# EAGLE design Wordclocktest (EAGLE 7.2.0)
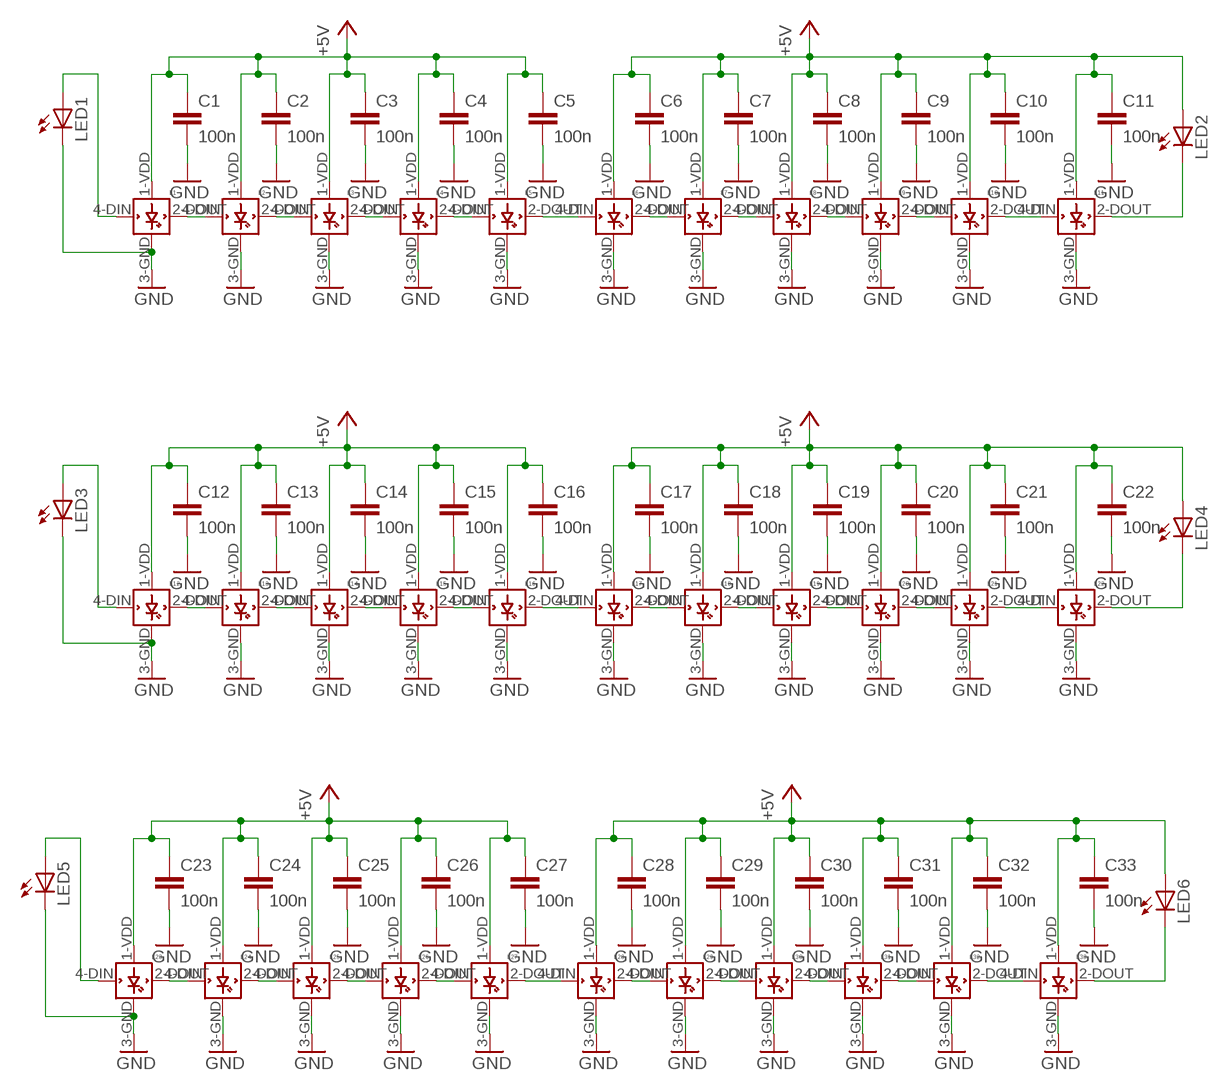
[diagram p0: schematic, sheet 1]

## Parts
C1  100n  C-EUC1310  [C1310]
C2  100n  C-EUC1310  [C1310]
C3  100n  C-EUC1310  [C1310]
C4  100n  C-EUC1310  [C1310]
C5  100n  C-EUC1310  [C1310]
C6  100n  C-EUC1310  [C1310]
C7  100n  C-EUC1310  [C1310]
C8  100n  C-EUC1310  [C1310]
C9  100n  C-EUC1310  [C1310]
C10  100n  C-EUC1310  [C1310]
C11  100n  C-EUC1310  [C1310]
C12  100n  C-EUC1310  [C1310]
C13  100n  C-EUC1310  [C1310]
C14  100n  C-EUC1310  [C1310]
C15  100n  C-EUC1310  [C1310]
C16  100n  C-EUC1310  [C1310]
C17  100n  C-EUC1310  [C1310]
C18  100n  C-EUC1310  [C1310]
C19  100n  C-EUC1310  [C1310]
C20  100n  C-EUC1310  [C1310]
C21  100n  C-EUC1310  [C1310]
C22  100n  C-EUC1310  [C1310]
C23  100n  C-EUC1310  [C1310]
C24  100n  C-EUC1310  [C1310]
C25  100n  C-EUC1310  [C1310]
C26  100n  C-EUC1310  [C1310]
C27  100n  C-EUC1310  [C1310]
C28  100n  C-EUC1310  [C1310]
C29  100n  C-EUC1310  [C1310]
C30  100n  C-EUC1310  [C1310]
C31  100n  C-EUC1310  [C1310]
C32  100n  C-EUC1310  [C1310]
C33  100n  C-EUC1310  [C1310]
L1  WS2812B  [WS2812B]
L2  WS2812B  [WS2812B]
L3  WS2812B  [WS2812B]
L4  WS2812B  [WS2812B]
L5  WS2812B  [WS2812B]
L6  WS2812B  [WS2812B]
L7  WS2812B  [WS2812B]
L8  WS2812B  [WS2812B]
L9  WS2812B  [WS2812B]
L10  WS2812B  [WS2812B]
L11  WS2812B  [WS2812B]
L12  WS2812B  [WS2812B]
L13  WS2812B  [WS2812B]
L14  WS2812B  [WS2812B]
L15  WS2812B  [WS2812B]
L16  WS2812B  [WS2812B]
L17  WS2812B  [WS2812B]
L18  WS2812B  [WS2812B]
L19  WS2812B  [WS2812B]
L20  WS2812B  [WS2812B]
L21  WS2812B  [WS2812B]
L22  WS2812B  [WS2812B]
L23  WS2812B  [WS2812B]
L24  WS2812B  [WS2812B]
L25  WS2812B  [WS2812B]
L26  WS2812B  [WS2812B]
L27  WS2812B  [WS2812B]
L28  WS2812B  [WS2812B]
L29  WS2812B  [WS2812B]
L30  WS2812B  [WS2812B]
L31  WS2812B  [WS2812B]
L32  WS2812B  [WS2812B]
L33  WS2812B  [WS2812B]
LED1  LEDCHIP-LED0603  [CHIP-LED0603]
LED2  LEDCHIP-LED0603  [CHIP-LED0603]
LED3  LEDCHIP-LED0603  [CHIP-LED0603]
LED4  LEDCHIP-LED0603  [CHIP-LED0603]
LED5  LEDCHIP-LED0603  [CHIP-LED0603]
LED6  LEDCHIP-LED0603  [CHIP-LED0603]

## Nets
+5V: C1.1 C2.1 C3.1 C4.1 C5.1 C6.1 C7.1 C8.1 C9.1 C10.1 C11.1 C12.1 C13.1 C14.1 C15.1 C16.1 C17.1 C18.1 C19.1 C20.1 C21.1 C22.1 C23.1 C24.1 C25.1 C26.1 C27.1 C28.1 C29.1 C30.1 C31.1 C32.1 C33.1 L1.1-VDD(VDD) L2.1-VDD(VDD) L3.1-VDD(VDD) L4.1-VDD(VDD) L5.1-VDD(VDD) L6.1-VDD(VDD) L7.1-VDD(VDD) L8.1-VDD(VDD) L9.1-VDD(VDD) L10.1-VDD(VDD) L11.1-VDD(VDD) L12.1-VDD(VDD) L13.1-VDD(VDD) L14.1-VDD(VDD) L15.1-VDD(VDD) L16.1-VDD(VDD) L17.1-VDD(VDD) L18.1-VDD(VDD) L19.1-VDD(VDD) L20.1-VDD(VDD) L21.1-VDD(VDD) L22.1-VDD(VDD) L23.1-VDD(VDD) L24.1-VDD(VDD) L25.1-VDD(VDD) L26.1-VDD(VDD) L27.1-VDD(VDD) L28.1-VDD(VDD) L29.1-VDD(VDD) L30.1-VDD(VDD) L31.1-VDD(VDD) L32.1-VDD(VDD) L33.1-VDD(VDD) LED2.A LED4.A LED6.A
GND: C1.2 C2.2 C3.2 C4.2 C5.2 C6.2 C7.2 C8.2 C9.2 C10.2 C11.2 C12.2 C13.2 C14.2 C15.2 C16.2 C17.2 C18.2 C19.2 C20.2 C21.2 C22.2 C23.2 C24.2 C25.2 C26.2 C27.2 C28.2 C29.2 C30.2 C31.2 C32.2 C33.2 L1.3-GND(GND) L2.3-GND(GND) L3.3-GND(GND) L4.3-GND(GND) L5.3-GND(GND) L6.3-GND(GND) L7.3-GND(GND) L8.3-GND(GND) L9.3-GND(GND) L10.3-GND(GND) L11.3-GND(GND) L12.3-GND(GND) L13.3-GND(GND) L14.3-GND(GND) L15.3-GND(GND) L16.3-GND(GND) L17.3-GND(GND) L18.3-GND(GND) L19.3-GND(GND) L20.3-GND(GND) L21.3-GND(GND) L22.3-GND(GND) L23.3-GND(GND) L24.3-GND(GND) L25.3-GND(GND) L26.3-GND(GND) L27.3-GND(GND) L28.3-GND(GND) L29.3-GND(GND) L30.3-GND(GND) L31.3-GND(GND) L32.3-GND(GND) L33.3-GND(GND) LED1.C LED3.C LED5.C
N$1: L1.2-DOUT(DOUT) L2.4-DIN(DIN)
N$2: L2.2-DOUT(DOUT) L3.4-DIN(DIN)
N$3: L3.2-DOUT(DOUT) L4.4-DIN(DIN)
N$4: L4.2-DOUT(DOUT) L5.4-DIN(DIN)
N$5: L6.2-DOUT(DOUT) L7.4-DIN(DIN)
N$6: L5.2-DOUT(DOUT) L6.4-DIN(DIN)
N$7: L7.2-DOUT(DOUT) L8.4-DIN(DIN)
N$8: L8.2-DOUT(DOUT) L9.4-DIN(DIN)
N$9: L9.2-DOUT(DOUT) L10.4-DIN(DIN)
N$10: L10.2-DOUT(DOUT) L11.4-DIN(DIN)
N$11: L12.2-DOUT(DOUT) L13.4-DIN(DIN)
N$12: L1.4-DIN(DIN) LED1.A
N$13: L13.2-DOUT(DOUT) L14.4-DIN(DIN)
N$14: L14.2-DOUT(DOUT) L15.4-DIN(DIN)
N$15: L15.2-DOUT(DOUT) L16.4-DIN(DIN)
N$16: L16.2-DOUT(DOUT) L17.4-DIN(DIN)
N$17: L17.2-DOUT(DOUT) L18.4-DIN(DIN)
N$18: L18.2-DOUT(DOUT) L19.4-DIN(DIN)
N$19: L19.2-DOUT(DOUT) L20.4-DIN(DIN)
N$20: L20.2-DOUT(DOUT) L21.4-DIN(DIN)
N$21: L21.2-DOUT(DOUT) L22.4-DIN(DIN)
N$22: L12.4-DIN(DIN) LED3.A
N$23: L23.2-DOUT(DOUT) L24.4-DIN(DIN)
N$24: L24.2-DOUT(DOUT) L25.4-DIN(DIN)
N$25: L25.2-DOUT(DOUT) L26.4-DIN(DIN)
N$26: L26.2-DOUT(DOUT) L27.4-DIN(DIN)
N$27: L27.2-DOUT(DOUT) L28.4-DIN(DIN)
N$28: L28.2-DOUT(DOUT) L29.4-DIN(DIN)
N$29: L29.2-DOUT(DOUT) L30.4-DIN(DIN)
N$30: L30.2-DOUT(DOUT) L31.4-DIN(DIN)
N$31: L31.2-DOUT(DOUT) L32.4-DIN(DIN)
N$32: L32.2-DOUT(DOUT) L33.4-DIN(DIN)
N$33: L23.4-DIN(DIN) LED5.A
OUTROW1: L11.2-DOUT(DOUT) LED2.C
OUTROW2: L22.2-DOUT(DOUT) LED4.C
OUTROW3: L33.2-DOUT(DOUT) LED6.C

## Library data of the parts
C1-C33 = rcl:C-EU: CAPACITOR, European symbol
L1-L33 = adafruit:WS2812B
LED1-LED6 = led:LED: LED OSRAM: - CHIPLED LG R971, LG N971, LY N971, LG Q971, LY Q971, LO R971, LY R971 LH N974, LH R974 LS Q976, LO Q976, LY Q976 LO Q996 - Hyper CHIPLED LW Q18S LB Q993, LB Q99A, LB R99A - SideLED LS A670, LO A670, LY A670, LG A670, LP A670 LB A673, LV A673, LT A673, LW A673 LH A674 LY A675 LS A676, LA A676, LO A676, LY A676, LW A676 LS A679, LY A679, LG A679 - Hyper Micro SIDELED® LS Y876, LA Y876, LO Y876, LY Y876 LT Y87S - SmartLED LW L88C, LW L88S LB L89C, LB L89S, LG L890 LS L89K, LO L89K, LY L89K LS L896, LA L896, LO L896, LY L896 - TOPLED LS T670, LO T670, LY T670, LG T670, LP T670 LSG T670, LSP T670, LSY T670, LOP T670, LYG T670 LG T671, LOG T671, LSG T671 LB T673, LV T673, LT T673, LW T673 LH T674 LS T676, LA T676, LO T676, LY T676, LB T676, LH T676, LSB T676, LW T676 LB T67C, LV T67C, LT T67C, LS T67K, LO T67K, LY T67K, LW E67C LS E67B, LA E67B, LO E67B, LY E67B, LB E67C, LV E67C, LT E67C LW T67C LS T679, LY T679, LG T679 LS T770, LO T770, LY T770, LG T770, LP T770 LB T773, LV T773, LT T773, LW T773 LH T774 LS E675, LA E675, LY E675, LS T675 LS T776, LA T776, LO T776, LY T776, LB T776 LHGB T686 LT T68C, LB T68C - Hyper Mini TOPLED® LB M676 - Mini TOPLED Santana® LG M470 LS M47K, LO M47K, LY M47K Source: http://www.osram.convergy.de LUXEON: - LUMILED® LXK2-PW12-R00, LXK2-PW12-S00, LXK2-PW14-U00, LXK2-PW14-V00 LXK2-PM12-R00, LXK2-PM12-S00, LXK2-PM14-U00 LXK2-PE12-Q00, LXK2-PE12-R00, LXK2-PE12-S00, LXK2-PE14-T00, LXK2-PE14-U00 LXK2-PB12-K00, LXK2-PB12-L00, LXK2-PB12-M00, LXK2-PB14-N00, LXK2-PB14-P00, LXK2-PB14-Q00 LXK2-PR12-L00, LXK2-PR12-M00, LXK2-PR14-Q00, LXK2-PR14-R00 LXK2-PD12-Q00, LXK2-PD12-R00, LXK2-PD12-S00 LXK2-PH12-R00, LXK2-PH12-S00 LXK2-PL12-P00, LXK2-PL12-Q00, LXK2-PL12-R00 Source: www.luxeon.com KINGBRIGHT: KA-3528ASYC Source: www.kingbright.com

## Board
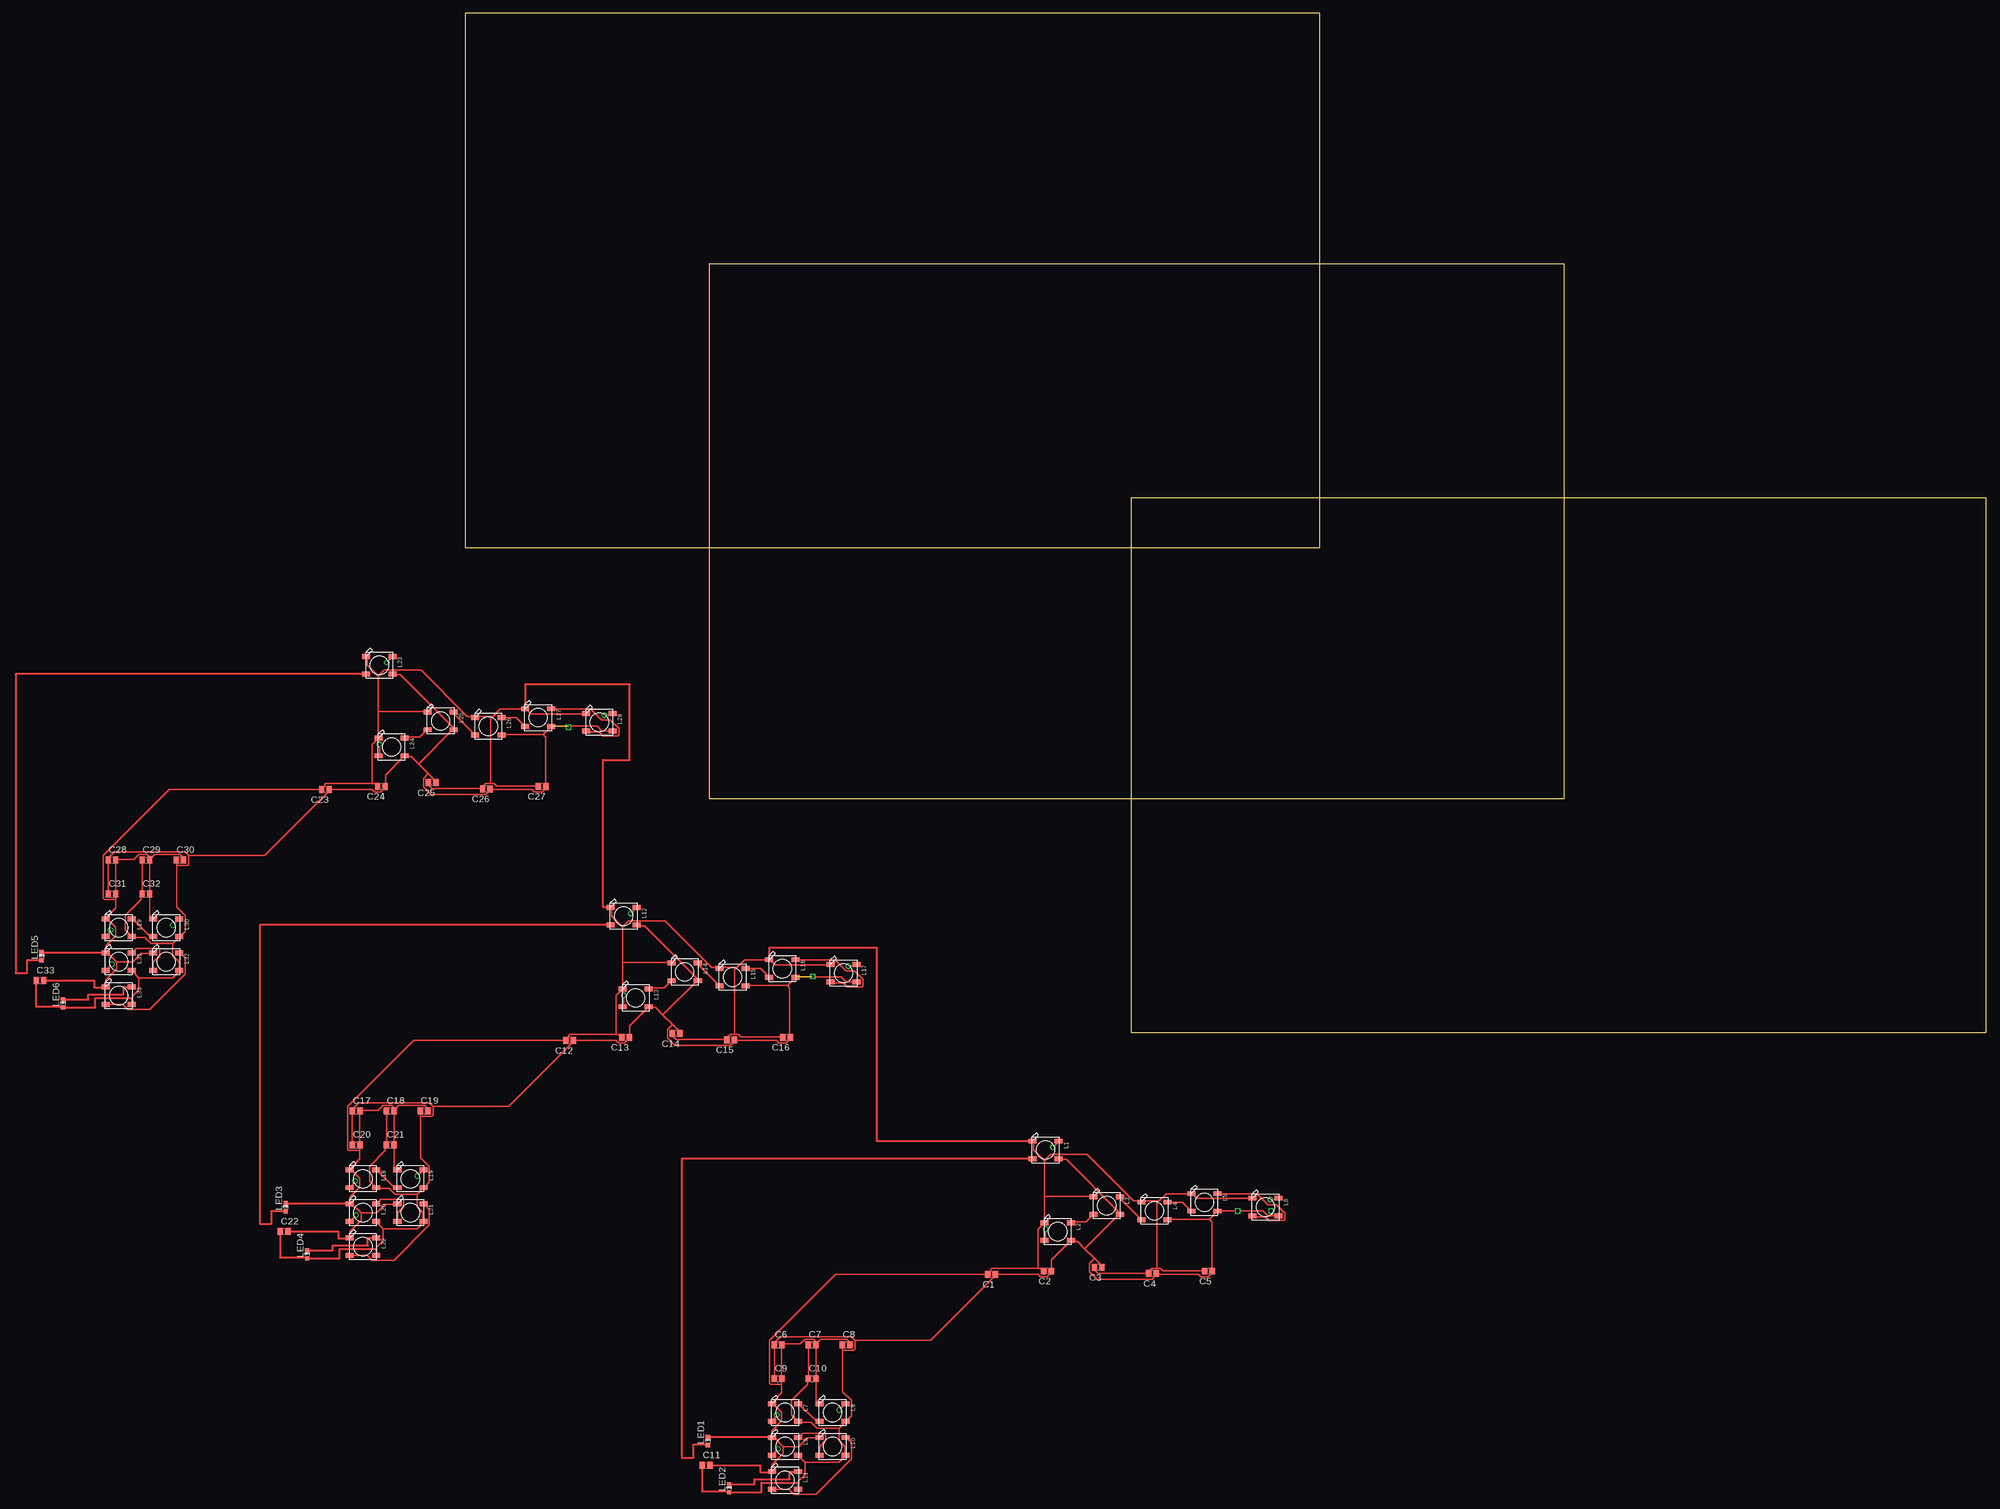
[diagram p1: board, top side]
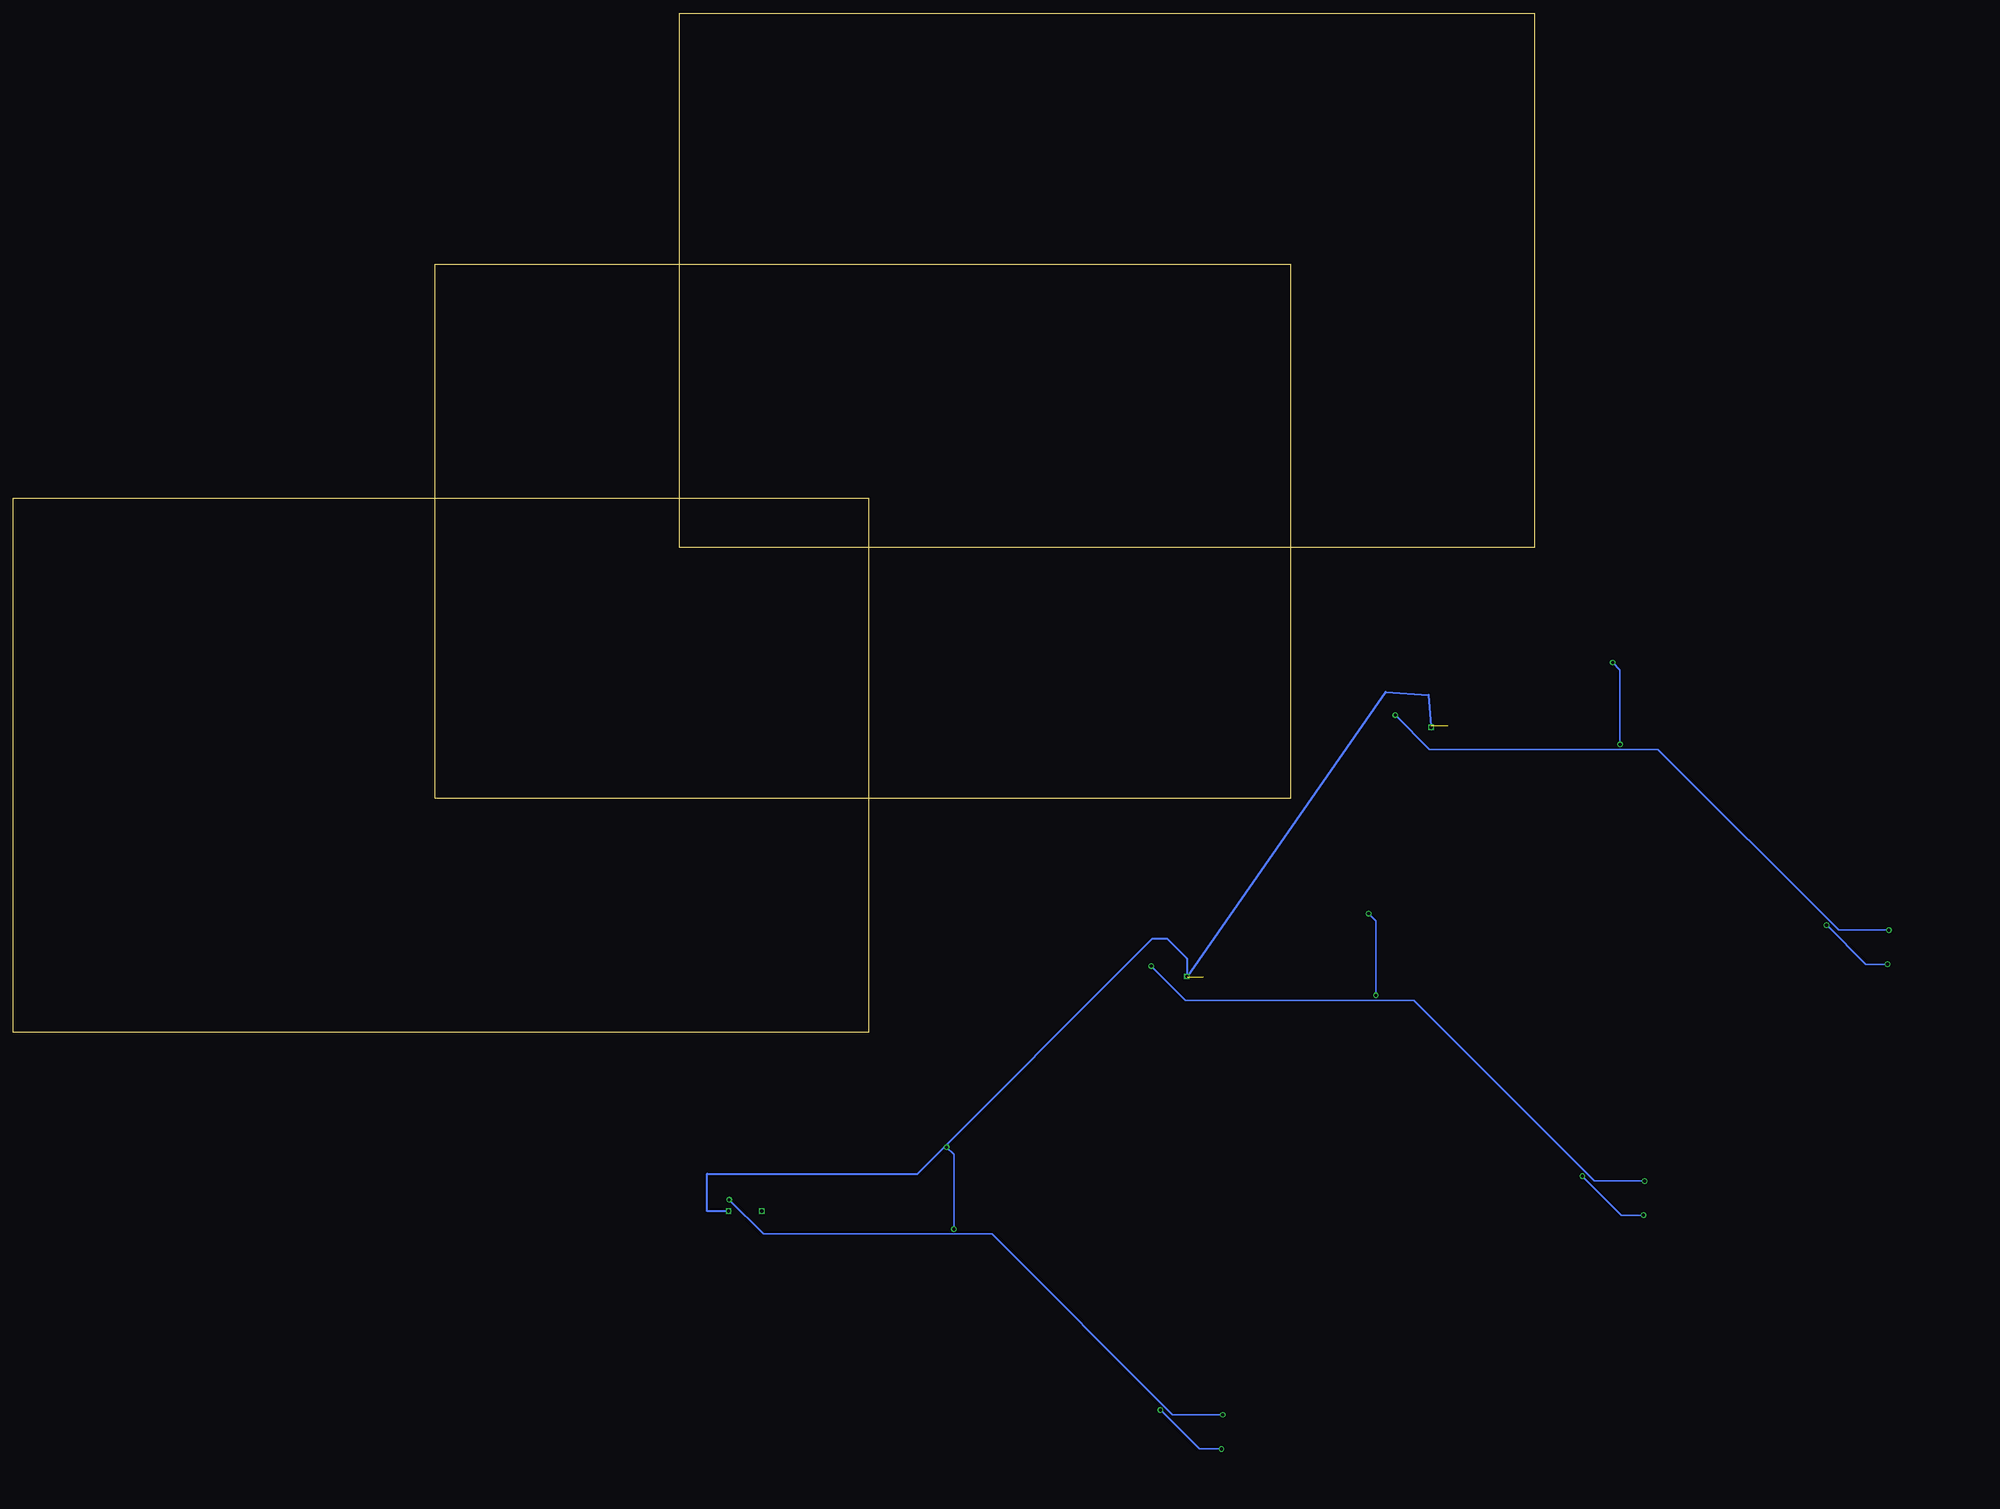
[diagram p2: board, bottom side, seen from below]

Size 284.65 x 190.71 mm. Coordinates in mm from the lower left corner, seen from the top.
Outline: 124.65,0 284.65,0 284.65,100 124.65,100 124.65,0
Outline: 45.69,43.75 205.69,43.75 205.69,143.75 45.69,143.75 45.69,43.75
Outline: 0,90.71 160,90.71 160,190.71 0,190.71 0,90.71
Copper layers (1*16): Top 0.035mm / dielectric 1.5mm / Bottom 0.035mm
Design rules "default": minimum track width 10mil, minimum drill 24mil, track to track 8mil, track to pad 8mil, pad to pad 8mil, via to via 8mil, smd to smd 8mil, copper to edge 40mil, drill to drill 8mil, minimum pad ring 10mil, minimum via ring 8mil, stop-mask expansion 4mil, vias tented up to drill 0mil, thermal gap 10mil

### Footprints (pad centres in the part's own frame; a part is rotated, then mirrored left to right if it is on the bottom)
C1310 = smd 1 x 1.3: 1 -0.7,0; 2 0.7,0
WS2812B = smd 1.5 x 0.9: 1-VDD 2.45,-1.65; 2-DOUT 2.45,1.65; 3-GND -2.45,1.65; 4-DIN -2.45,-1.65
CHIP-LED0603 = smd 0.8 x 0.8: A 0,-0.75; C 0,0.75

### Placement (x,y rotation side)
C1  98.55,-45.26 180 top  (outside the outline)
C2  109.02,-44.65 180 top  (outside the outline)
C3  118.49,-43.97 180 top  (outside the outline)
C4  128.65,-45.11 180 top  (outside the outline)
C5  139.12,-44.65 180 top  (outside the outline)
C6  58.61,-58.42 0 top  (outside the outline)
C7  64.96,-58.42 0 top  (outside the outline)
C8  71.31,-58.42 0 top  (outside the outline)
C9  58.61,-64.77 0 top  (outside the outline)
C10  64.96,-64.77 0 top  (outside the outline)
C11  45.12,-81 0 top  (outside the outline)
C12  19.59,-1.51 180 top
C13  30.06,-0.9 180 top
C14  39.53,-0.22 180 top
C15  49.69,-1.36 180 top
C16  60.16,-0.9 180 top
C17  -20.35,-14.67 0 top  (outside the outline)
C18  -14,-14.67 0 top  (outside the outline)
C19  -7.65,-14.67 0 top  (outside the outline)
C20  -20.35,-21.02 0 top  (outside the outline)
C21  -14,-21.02 0 top  (outside the outline)
C22  -33.84,-37.25 0 top  (outside the outline)
C23  -26.1,45.45 180 top  (outside the outline)
C24  -15.64,46.06 180 top  (outside the outline)
C25  -6.16,46.74 180 top  (outside the outline)
C26  4,45.6 180 top
C27  14.46,46.06 180 top
C28  -66.04,32.29 0 top  (outside the outline)
C29  -59.69,32.29 0 top  (outside the outline)
C30  -53.34,32.29 0 top  (outside the outline)
C31  -66.04,25.94 0 top  (outside the outline)
C32  -59.69,25.94 0 top  (outside the outline)
C33  -79.53,9.71 0 top  (outside the outline)
L1  108.65,-22 0 top  (outside the outline)
L2  110.92,-37.27 0 top  (outside the outline)
L3  120.09,-32.41 0 top  (outside the outline)
L4  129.03,-33.4 0 top  (outside the outline)
L5  138.36,-31.8 0 top  (outside the outline)
L6  149.8,-32.67 0 top  (outside the outline)
L7  59.88,-71.12 0 top  (outside the outline)
L8  68.77,-71.12 0 top  (outside the outline)
L9  59.88,-77.47 0 top  (outside the outline)
L10  68.77,-77.47 0 top  (outside the outline)
L11  59.88,-83.82 0 top  (outside the outline)
L12  29.69,21.75 0 top
L13  31.96,6.48 0 top
L14  41.13,11.34 0 top
L15  50.07,10.36 0 top
L16  59.4,11.95 0 top
L17  70.84,11.09 0 top
L18  -19.08,-27.37 0 top  (outside the outline)
L19  -10.19,-27.37 0 top  (outside the outline)
L20  -19.08,-33.72 0 top  (outside the outline)
L21  -10.19,-33.72 0 top  (outside the outline)
L22  -19.08,-40.07 0 top  (outside the outline)
L23  -16,68.71 0 top  (outside the outline)
L24  -13.74,53.44 0 top  (outside the outline)
L25  -4.56,58.3 0 top
L26  4.38,57.32 0 top
L27  13.7,58.91 0 top
L28  25.15,58.05 0 top
L29  -64.77,19.59 0 top  (outside the outline)
L30  -55.88,19.59 0 top  (outside the outline)
L31  -64.77,13.24 0 top  (outside the outline)
L32  -55.88,13.24 0 top  (outside the outline)
L33  -64.77,6.89 0 top  (outside the outline)
LED1  45.44,-76.45 0 top  (outside the outline)
LED2  49.43,-85.29 0 top  (outside the outline)
LED3  -33.52,-32.7 0 top  (outside the outline)
LED4  -29.53,-41.54 0 top  (outside the outline)
LED5  -79.22,14.26 0 top  (outside the outline)
LED6  -75.23,5.43 0 top  (outside the outline)

### Tracks (layer width: path | path; a pad name or v marks a point on that pad's centre or on a via)
+5V  (via drill 0.6)  (2 unrouted)
  Top 0.254: 63.62,-80.47 63.62,-82.75 62.47,-83.9 62.47,-85.27 L11.1-VDD | 63.62,-80.47 62.47,-79.32 L9.1-VDD | C7.1 64.3,-58.52 64.3,-64.69 C10.1 64.07,-64.92 64.07,-65.84 61.1,-68.81 61.1,-71.55 62.24,-72.69 L7.1-VDD 62.47,-72.92 64.76,-72.92 65.9,-74.07 70.02,-74.07 | C9.1 57.9,-64.69 57.9,-58.52 C6.1 58.13,-58.29 58.13,-57.84 59.04,-56.92 72.3,-56.92 72.99,-57.61 | 70.7,-59.44 70.7,-67.21 72.3,-68.81 72.3,-71.78 71.39,-72.69 L8.1-VDD 71.16,-72.92 70.02,-74.07 | 70.7,-59.44 70.7,-58.52 C8.1 | 70.02,-74.07 70.02,-76.35 71.16,-77.5 71.16,-79.1 L10.1-VDD 71.16,-79.32 70.02,-80.47 63.62,-80.47 | 72.99,-57.61 72.99,-59.21 72.76,-59.44 70.7,-59.44 | 139.28,-34.98 131.51,-34.98 L4.1-VDD | 139.28,-34.98 140.65,-33.6 L5.1-VDD 140.88,-33.38 149.34,-33.38 150.26,-34.29 152.08,-34.29 L6.1-VDD | 139.28,-34.98 139.74,-35.43 139.74,-44.58 C5.1 139.97,-44.81 139.05,-45.72 137.68,-45.72 137.23,-45.26 129.45,-45.26 C4.1 129.22,-45.26 129.22,-45.49 128.54,-46.18 118.25,-46.18 116.88,-44.81 116.88,-43.2 117.79,-42.29 | 99.51,-45.26 107.28,-45.26 107.74,-45.72 108.88,-45.72 109.79,-44.81 C2.1 109.79,-44.58 109.79,-42.52 113.22,-39.09 L2.1-VDD 113.45,-39.09 114.59,-39.09 115.97,-40.46 | 99.51,-45.26 99.28,-45.26 C1.1 99.51,-45.26 | 115.97,-40.46 117.79,-42.29 | 117.79,-42.29 118.71,-43.2 118.71,-43.43 119.17,-43.89 C3.1 | 115.97,-40.46 122.37,-34.06 L3.1-VDD 122.6,-33.83 112.54,-23.77 111.17,-23.77 L1.1-VDD | 72.99,-57.61 87.16,-57.61 99.51,-45.26 | -15.34,-36.72 -15.34,-39 -16.49,-40.15 -16.49,-41.52 L22.1-VDD | -15.34,-36.72 -16.49,-35.57 L20.1-VDD | C18.1 -14.66,-14.77 -14.66,-20.94 C21.1 -14.89,-21.17 -14.89,-22.09 -17.86,-25.06 -17.86,-27.8 -16.72,-28.95 L18.1-VDD -16.49,-29.17 -14.2,-29.17 -13.06,-30.32 -8.94,-30.32
  Top 0.254: C20.1 -21.06,-20.94 -21.06,-14.77 C17.1 -20.83,-14.54 -20.83,-14.09 -19.92,-13.17 -6.66,-13.17 -5.97,-13.86 | -8.26,-15.69 -8.26,-23.46 -6.66,-25.06 -6.66,-28.03 -7.57,-28.95 L19.1-VDD -7.8,-29.17 -8.94,-30.32 | -8.26,-15.69 -8.26,-14.77 C19.1 | -8.94,-30.32 -8.94,-32.6 -7.8,-33.74 -7.8,-35.34 L21.1-VDD -7.8,-35.57 -8.94,-36.72 -15.34,-36.72 | -5.97,-13.86 -5.97,-15.46 -6.2,-15.69 -8.26,-15.69 | 60.32,8.77 52.55,8.77 L15.1-VDD | 60.32,8.77 61.69,10.15 L16.1-VDD 61.92,10.38 70.38,10.38 71.3,9.46 73.12,9.46 L17.1-VDD | 60.32,8.77 60.78,8.32 60.78,-0.83 C16.1 61.01,-1.05 60.09,-1.97 58.72,-1.97 58.27,-1.51 50.49,-1.51 C15.1 50.26,-1.51 50.26,-1.74 49.58,-2.43 39.29,-2.43 37.92,-1.05 37.92,0.55 38.83,1.46 | 20.55,-1.51 28.32,-1.51 28.78,-1.97 29.92,-1.97 30.83,-1.05 C13.1 30.83,-0.83 30.83,1.23 34.26,4.66 L13.1-VDD 34.49,4.66 35.63,4.66 37.01,3.29 | 20.55,-1.51 20.32,-1.51 C12.1 20.55,-1.51 | 37.01,3.29 38.83,1.46 | 38.83,1.46 39.75,0.55 39.75,0.32 40.21,-0.14 C14.1 | 37.01,3.29 43.41,9.69 L14.1-VDD 43.64,9.92 33.58,19.98 32.21,19.98 L12.1-VDD | -5.97,-13.86 8.2,-13.86 20.55,-1.51 | -61.04,10.24 -61.04,7.96 -62.18,6.82 -62.18,5.44 L33.1-VDD | -61.04,10.24 -62.18,11.39 L31.1-VDD | C29.1 -60.35,32.19 -60.35,26.02 C32.1 -60.58,25.79 -60.58,24.88 -63.55,21.9 -63.55,19.16 -62.41,18.02 L29.1-VDD -62.18,17.79 -59.89,17.79 -58.75,16.64 -54.64,16.64 | C31.1 -66.75,26.02 -66.75,32.19 C28.1 -66.52,32.42 -66.52,32.88 -65.61,33.79 -52.35,33.79 -51.66,33.1 | -53.95,31.27 -53.95,23.5 -52.35,21.9 -52.35,18.93 -53.26,18.02 L30.1-VDD -53.49,17.79 -54.64,16.64
  Top 0.254: -53.95,31.27 -53.95,32.19 C30.1 | -54.64,16.64 -54.64,14.36 -53.49,13.22 -53.49,11.62 L32.1-VDD -53.49,11.39 -54.64,10.24 -61.04,10.24 | -51.66,33.1 -51.66,31.5 -51.89,31.27 -53.95,31.27 | 14.63,55.74 6.86,55.74 L26.1-VDD | 14.63,55.74 16,57.11 L27.1-VDD 16.23,57.34 24.69,57.34 25.6,56.42 27.43,56.42 L28.1-VDD | 14.63,55.74 15.09,55.28 15.09,46.13 C27.1 15.32,45.91 14.4,44.99 13.03,44.99 12.57,45.45 4.8,45.45 C26.1 4.57,45.45 4.57,45.22 3.89,44.53 -6.4,44.53 -7.77,45.91 -7.77,47.51 -6.86,48.42 | -25.15,45.45 -17.37,45.45 -16.92,44.99 -15.77,44.99 -14.86,45.91 C24.1 -14.86,46.13 -14.86,48.19 -11.43,51.62 L24.1-VDD -11.2,51.62 -10.06,51.62 -8.69,50.25 | -25.15,45.45 -25.37,45.45 C23.1 -25.15,45.45 | -8.69,50.25 -6.86,48.42 | -6.86,48.42 -5.94,47.51 -5.94,47.28 -5.49,46.82 C25.1 | -8.69,50.25 -2.29,56.65 L25.1-VDD -2.06,56.88 -12.12,66.94 -13.49,66.94 L23.1-VDD | -51.66,33.1 -37.49,33.1 -25.15,45.45
  Top 0.406: C11.1 44.37,-81 44.37,-85.88 49.43,-85.88 LED2.A 55.5,-86.04 55.5,-84.26 62.33,-84.26 L11.1-VDD | C22.1 -34.59,-37.25 -34.59,-42.13 -29.53,-42.13 LED4.A -23.46,-42.29 -23.46,-40.51 -16.63,-40.51 L22.1-VDD | C33.1 -80.29,9.71 -80.29,4.83 -75.23,4.83 LED6.A -69.15,4.67 -69.15,6.45 -62.32,6.45 L33.1-VDD | L6.1-VDD 150.83,-34.31 v150.83,-33.44
  Bottom 0.406: v150.83,-33.44 154.82,-33.44 154.82,-26.42 115.43,-26.42 71.46,17.56 68.79,17.56 65.05,13.82 65.05,10.44 64.98,10.38 27.84,63.74 19.86,63.17 19.38,57.34
GND
  Top 0.254: 127.62,-45.03 118.48,-45.03 117.57,-44.12 C3.2 | 127.62,-45.03 127.85,-45.03 C4.2 127.62,-45.03 | 129.45,-44.12 128.54,-44.12 127.62,-45.03 | 129.45,-44.12 130.14,-44.12 130.6,-44.58 138.37,-44.58 C5.2 | 129.45,-31.55 129.91,-31.55 131.28,-30.18 135.85,-30.18 L5.3-GND 136.08,-30.18 137,-31.09 147.28,-31.09 L6.3-GND | 129.45,-31.55 126.71,-31.55 L4.3-GND 126.48,-31.55 125.11,-31.55 116.42,-22.86 109.56,-22.86 108.42,-24 | 129.45,-31.55 129.45,-44.12 | 59.5,-77.5 59.5,-78.87 57.44,-80.92 57.44,-82.07 L11.3-GND | 59.5,-77.5 57.9,-75.89 57.44,-75.89 L9.3-GND 57.44,-75.67 57.44,-74.52 59.27,-72.69 59.27,-71.09 57.44,-69.27 | 59.5,-77.5 62.47,-77.5 64.07,-75.89 66.13,-75.89 L10.3-GND | 59.27,-65.84 59.27,-67.44 57.44,-69.27 | 59.27,-65.84 59.27,-64.92 C9.2 59.27,-64.69 59.27,-58.52 C6.2 59.5,-58.29 62.7,-58.29 63.62,-57.38 65.22,-57.38 65.9,-58.06 | L8.3-GND 66.13,-69.27 65.67,-68.81 65.67,-64.92 C10.2 65.67,-64.69 65.67,-58.52 C7.2 | 65.9,-58.06 65.67,-58.29 C7.2 | 65.9,-58.06 66.59,-57.38 71.39,-57.38 71.85,-57.84 71.85,-58.29 C8.2 | 65.9,-58.06 C7.2 | 57.44,-69.27 L7.3-GND | 107.28,-44.12 107.74,-44.12 108.19,-44.58 C2.2 | 107.28,-44.12 98.59,-44.12 98.36,-44.35 98.36,-44.58 97.91,-45.03 C1.2 97.68,-45.26 69.33,-45.26 56.99,-57.61 56.99,-65.61 57.22,-65.84 59.27,-65.84 | 107.28,-44.12 107.28,-36.8 108.42,-35.66 L2.3-GND 108.42,-35.43 108.42,-30.63 | 108.42,-24 106.36,-21.95 106.36,-20.57 L1.3-GND | 108.42,-30.63 108.42,-24 | 108.42,-30.63 117.57,-30.63 L3.3-GND | 48.66,-1.28 39.52,-1.28 38.61,-0.37 C14.2 | 48.66,-1.28 48.89,-1.28 C15.2 48.66,-1.28 | 50.49,-0.37 49.58,-0.37 48.66,-1.28
  Top 0.254: 50.49,-0.37 51.18,-0.37 51.64,-0.83 59.41,-0.83 C16.2 | 50.49,12.2 50.95,12.2 52.32,13.57 56.89,13.57 L16.3-GND 57.12,13.57 58.04,12.66 68.32,12.66 L17.3-GND | 50.49,12.2 47.75,12.2 L15.3-GND 47.52,12.2 46.15,12.2 37.46,20.89 30.61,20.89 29.46,19.75 | 50.49,12.2 50.49,-0.37 | -19.46,-33.74 -19.46,-35.12 -21.52,-37.17 -21.52,-38.32 L22.3-GND | -19.46,-33.74 -21.06,-32.15 -21.52,-32.15 L20.3-GND -21.52,-31.92 -21.52,-30.77 -19.69,-28.95 -19.69,-27.34 -21.52,-25.52 | -19.46,-33.74 -16.49,-33.74 -14.89,-32.15 -12.83,-32.15 L21.3-GND | -19.69,-22.09 -19.69,-23.69 -21.52,-25.52 | -19.69,-22.09 -19.69,-21.17 C20.2 -19.69,-20.94 -19.69,-14.77 C17.2 -19.46,-14.54 -16.26,-14.54 -15.34,-13.63 -13.74,-13.63 -13.06,-14.31 | L19.3-GND -12.83,-25.52 -13.29,-25.06 -13.29,-21.17 C21.2 -13.29,-20.94 -13.29,-14.77 C18.2 | -13.06,-14.31 -13.29,-14.54 C18.2 | -13.06,-14.31 -12.37,-13.63 -7.57,-13.63 -7.11,-14.09 -7.11,-14.54 C19.2 | -13.06,-14.31 C18.2 | -21.52,-25.52 L18.3-GND | 28.32,-0.37 28.78,-0.37 29.23,-0.83 C13.2 | 28.32,-0.37 19.63,-0.37 19.4,-0.6 19.4,-0.83 18.95,-1.28 C12.2 18.72,-1.51 -9.63,-1.51 -21.97,-13.86 -21.97,-21.86 -21.74,-22.09 -19.69,-22.09 | 28.32,-0.37 28.32,6.95 29.46,8.09 L13.3-GND 29.46,8.32 29.46,13.12 | 29.46,19.75 27.4,21.8 27.4,23.18 L12.3-GND | 29.46,13.12 29.46,19.75 | 29.46,13.12 38.61,13.12 L14.3-GND | 2.97,45.68 -6.17,45.68 -7.09,46.59 C25.2 | 2.97,45.68 3.2,45.68 C26.2 2.97,45.68 | 4.8,46.59 3.89,46.59 2.97,45.68 | 4.8,46.59 5.49,46.59 5.94,46.13 13.72,46.13 C27.2 | 4.8,59.16 5.26,59.16 6.63,60.54 11.2,60.54 L27.3-GND 11.43,60.54 12.34,59.62 22.63,59.62 L28.3-GND
  Top 0.254: 4.8,59.16 2.06,59.16 L26.3-GND 1.83,59.16 0.46,59.16 -8.23,67.85 -15.09,67.85 -16.23,66.71 | 4.8,59.16 4.8,46.59 | -65.15,13.22 -65.15,11.84 -67.21,9.79 -67.21,8.64 L33.3-GND | -65.15,13.22 -66.75,14.82 -67.21,14.82 L31.3-GND -67.21,15.04 -67.21,16.19 -65.38,18.02 -65.38,19.62 -67.21,21.45 | -65.15,13.22 -62.18,13.22 -60.58,14.82 -58.52,14.82 L32.3-GND | -65.38,24.88 -65.38,23.27 -67.21,21.45 | -65.38,24.88 -65.38,25.79 C31.2 -65.38,26.02 -65.38,32.19 C28.2 -65.15,32.42 -61.95,32.42 -61.04,33.33 -59.44,33.33 -58.75,32.65 | L30.3-GND -58.52,21.45 -58.98,21.9 -58.98,25.79 C32.2 -58.98,26.02 -58.98,32.19 C29.2 | -58.75,32.65 -58.98,32.42 C29.2 | -58.75,32.65 -58.06,33.33 -53.26,33.33 -52.81,32.88 -52.81,32.42 C30.2 | -58.75,32.65 C29.2 | -67.21,21.45 L29.3-GND | -17.37,46.59 -16.92,46.59 -16.46,46.13 C24.2 | -17.37,46.59 -26.06,46.59 -26.29,46.36 -26.29,46.13 -26.75,45.68 C23.2 -26.97,45.45 -55.32,45.45 -67.67,33.1 -67.67,25.1 -67.44,24.88 -65.38,24.88 | -17.37,46.59 -17.37,53.91 -16.23,55.05 L24.3-GND -16.23,55.28 -16.23,60.08 | -16.23,66.71 -18.29,68.77 -18.29,70.14 L23.3-GND | -16.23,60.08 -16.23,66.71 | -16.23,60.08 -7.09,60.08 L25.3-GND
  Top 0.406: LED1.C 57.43,-75.7 L9.3-GND | C11.2 55.26,-81 55.26,-82.28 57.43,-82.28 L11.3-GND | LED3.C -21.53,-31.95 L20.3-GND | C22.2 -23.7,-37.25 -23.7,-38.53 -21.53,-38.53 L22.3-GND | LED5.C -67.22,15.01 L31.3-GND | C33.2 -69.39,9.71 -69.39,8.43 -67.22,8.43 L33.3-GND | L1.3-GND 77.07,-20.35 77.07,15.82 56.95,15.82 L16.3-GND | L12.3-GND 25.83,23.4 25.83,51.02 30.82,51.02 30.82,65.1 11.25,65.1 L27.3-GND
N$1  (via drill 0.61)
  Top 0.254: v108.65,-36.8 108.65,-38.86 L2.4-DIN | v110.02,-21.49 110.94,-20.57 L1.2-DOUT
  Bottom 0.254: v108.65,-36.8 108.65,-22.86 v110.02,-21.49
N$2
  Top 0.254: L2.2-DOUT 113.45,-35.43 116.19,-35.43 117.57,-34.06 L3.4-DIN
N$3
  Top 0.254: L4.4-DIN 126.48,-34.98 122.37,-30.86 L3.2-DOUT
N$4
  Top 0.254: L4.2-DOUT 131.51,-31.77 134.25,-31.77 135.85,-33.38 L5.4-DIN
N$5  (via drill 0.61)
  Top 0.254: v58.36,-71.55 58.36,-71.78 57.44,-72.69 L7.4-DIN | v150.71,-31.32 151.86,-31.32 152.08,-31.09 L6.2-DOUT
  Bottom 0.254: v58.36,-71.55 67.73,-71.55 101.56,-37.72 144.31,-37.72 v150.71,-31.32
N$6
  Top 0.254: L6.4-DIN 147.51,-34.52 149.8,-34.52 150.48,-35.2 153.23,-35.2 153.46,-34.98 153.46,-33.83 151.86,-32.23 150.26,-32.23 148.2,-30.18 140.88,-30.18 L5.2-DOUT
N$7
  Top 0.254: L8.4-DIN 66.13,-72.69 65.67,-72.69 62.47,-69.49 L7.2-DOUT
N$8  (via drill 0.61)
  Top 0.254: v58.59,-77.95 57.44,-79.1 L9.4-DIN | v70.02,-70.64 71.16,-69.49 L8.2-DOUT
  Bottom 0.254: v58.59,-77.95 62.7,-77.95 v70.02,-70.64
N$9
  Top 0.254: L10.4-DIN 66.36,-79.1 66.36,-77.5 67.5,-76.35 67.5,-75.21 67.27,-74.98 63.16,-74.98 62.47,-75.67 L9.2-DOUT
N$10
  Top 0.254: L11.4-DIN 57.44,-85.5 60.64,-85.5 61.56,-86.41 65.67,-86.41 72.3,-79.78 72.3,-76.81 71.39,-75.89 L10.2-DOUT
N$11  (via drill 0.61)
  Top 0.254: v29.69,6.95 29.69,4.89 L13.4-DIN | v31.06,22.26 31.98,23.18 L12.2-DOUT
  Bottom 0.254: v29.69,6.95 29.69,20.89 v31.06,22.26
N$12
  Top 0.406: L1.4-DIN 40.56,-23.65 40.56,-79.65 42.69,-79.65 42.69,-77.2 LED1.A
N$13
  Top 0.254: L13.2-DOUT 34.49,8.32 37.23,8.32 38.61,9.69 L14.4-DIN
N$14
  Top 0.254: L15.4-DIN 47.52,8.77 43.41,12.89 L14.2-DOUT
N$15
  Top 0.254: L15.2-DOUT 52.55,11.97 55.29,11.97 56.89,10.38 L16.4-DIN
N$16
  Top 0.254: L17.4-DIN 68.55,9.23 70.84,9.23 71.52,8.55 74.27,8.55 74.5,8.77 74.5,9.92 72.9,11.52 71.3,11.52 69.24,13.57 61.92,13.57 L16.2-DOUT
N$17  (via drill 0.61)
  Top 0.254: v-20.6,-27.8 -20.6,-28.03 -21.52,-28.95 L18.4-DIN | v71.75,12.43 72.9,12.43 73.12,12.66 L17.2-DOUT
  Bottom 0.254: v-20.6,-27.8 -11.23,-27.8 22.6,6.03 65.35,6.03 v71.75,12.43
N$18
  Top 0.254: L19.4-DIN -12.83,-28.95 -13.29,-28.95 -16.49,-25.74 L18.2-DOUT
N$19  (via drill 0.61)
  Top 0.254: v-20.37,-34.2 -21.52,-35.34 L20.4-DIN | v-8.94,-26.89 -7.8,-25.74 L19.2-DOUT
  Bottom 0.254: v-20.37,-34.2 -16.26,-34.2 v-8.94,-26.89
N$20
  Top 0.254: L21.4-DIN -12.6,-35.34 -12.6,-33.74 -11.46,-32.6 -11.46,-31.46 -11.69,-31.23 -15.8,-31.23 -16.49,-31.92 L20.2-DOUT
N$21
  Top 0.254: L22.4-DIN -21.52,-41.75 -18.32,-41.75 -17.4,-42.66 -13.29,-42.66 -6.66,-36.03 -6.66,-33.06 -7.57,-32.15 L21.2-DOUT
N$22
  Top 0.406: L12.4-DIN -38.4,20.1 -38.4,-35.9 -36.27,-35.9 -36.27,-33.45 LED3.A
N$23  (via drill 0.61)
  Top 0.254: v-16,53.91 -16,51.85 L24.4-DIN | v-14.63,69.22 -13.72,70.14 L23.2-DOUT
  Bottom 0.254: v-16,53.91 -16,67.85 v-14.63,69.22
N$24
  Top 0.254: L24.2-DOUT -11.2,55.28 -8.46,55.28 -7.09,56.65 L25.4-DIN
N$25
  Top 0.254: L26.4-DIN 1.83,55.74 -2.29,59.85 L25.2-DOUT
N$26
  Top 0.254: L26.2-DOUT 6.86,58.94 9.6,58.94 11.2,57.34 L27.4-DIN
N$27
  Top 0.254: L28.4-DIN 22.86,56.19 25.15,56.19 25.83,55.51 28.58,55.51 28.8,55.74 28.8,56.88 27.2,58.48 25.6,58.48 23.55,60.54 16.23,60.54 L27.2-DOUT
N$28  (via drill 0.61)
  Top 0.254: v-66.29,19.16 -66.29,18.93 -67.21,18.02 L29.4-DIN | v26.06,59.39 27.2,59.39 27.43,59.62 L28.2-DOUT
  Bottom 0.254: v-66.29,19.16 -56.92,19.16 -23.09,52.99 19.66,52.99 v26.06,59.39
N$29
  Top 0.254: L30.4-DIN -58.52,18.02 -58.98,18.02 -62.18,21.22 L29.2-DOUT
N$30  (via drill 0.61)
  Top 0.254: v-66.07,12.76 -67.21,11.62 L31.4-DIN | v-54.64,20.07 -53.49,21.22 L30.2-DOUT
  Bottom 0.254: v-66.07,12.76 -61.95,12.76 v-54.64,20.07
N$31
  Top 0.254: L32.4-DIN -58.29,11.62 -58.29,13.22 -57.15,14.36 -57.15,15.5 -57.38,15.73 -61.49,15.73 -62.18,15.04 L31.2-DOUT
N$32
  Top 0.254: L33.4-DIN -67.21,5.21 -64.01,5.21 -63.09,4.3 -58.98,4.3 -52.35,10.93 -52.35,13.9 -53.26,14.82 L32.2-DOUT
N$33
  Top 0.406: L23.4-DIN -84.09,67.06 -84.09,11.06 -81.96,11.06 -81.96,13.51 LED5.A
OUTROW1
  Top 0.406: LED2.C 54.19,-84.54 54.19,-83.6 60.77,-83.6 60.77,-82.22 62.33,-82.22 L11.2-DOUT
OUTROW2
  Top 0.406: LED4.C -24.77,-40.79 -24.77,-39.85 -18.19,-39.85 -18.19,-38.47 -16.63,-38.47 L22.2-DOUT
OUTROW3
  Top 0.406: LED6.C -70.47,6.17 -70.47,7.11 -63.88,7.11 -63.88,8.49 -62.32,8.49 L33.2-DOUT
S$1  (via drill 0.6)
  other vias: 19.34,57.11
S$2  (via drill 0.6)
  other vias: 65.06,10.48
S$3  (via drill 0.6)
  other vias: 144.62,-33.45
S$4  (via drill 0.6)
  other vias: 150.83,-33.4